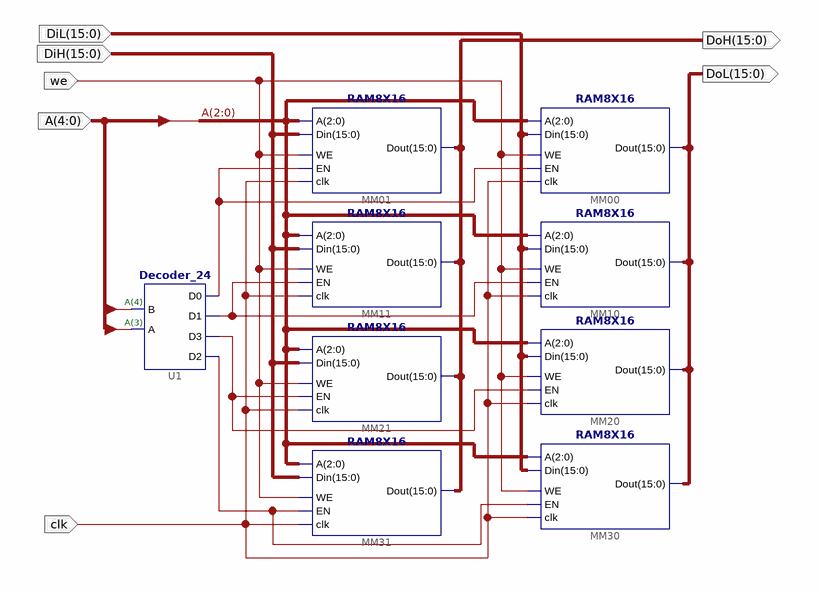
[diagram p0: schematic sheet 1]
// Xilinx ISE schematic MEM_BANK.sch (spartan3) as structural Verilog: 9 symbols, 7 ports
module MEM_BANK (
  input  [15:0] DiH,
  input  we,
  input  clk,
  input  [15:0] DiL,
  input  [4:0] A,
  output [15:0] DoH,
  output [15:0] DoL
);

  wire XLXN_3, XLXN_6, XLXN_8, XLXN_194;

  Decoder_24 U1 (.B(A[4]), .A(A[3]), .D0(XLXN_3), .D1(XLXN_6), .D3(XLXN_8), .D2(XLXN_194));
  RAM8X16 MM01 (.Dout(DoH), .Din(DiH), .A(A[2:0]), .clk(clk), .EN(XLXN_3), .WE(we));
  RAM8X16 MM11 (.Dout(DoH), .Din(DiH), .A(A[2:0]), .clk(clk), .EN(XLXN_6), .WE(we));
  RAM8X16 MM21 (.Dout(DoH), .Din(DiH), .A(A[2:0]), .clk(clk), .EN(XLXN_8), .WE(we));
  RAM8X16 MM31 (.Dout(DoH), .Din(DiH), .A(A[2:0]), .clk(clk), .EN(XLXN_194), .WE(we));
  RAM8X16 MM00 (.Dout(DoL), .Din(DiL), .A(A[2:0]), .clk(clk), .EN(XLXN_3), .WE(we));
  RAM8X16 MM10 (.Dout(DoL), .Din(DiL), .A(A[2:0]), .clk(clk), .EN(XLXN_6), .WE(we));
  RAM8X16 MM20 (.Dout(DoL), .Din(DiL), .A(A[2:0]), .clk(clk), .EN(XLXN_8), .WE(we));
  RAM8X16 MM30 (.Dout(DoL), .Din(DiL), .A(A[2:0]), .clk(clk), .EN(XLXN_194), .WE(we));

  // Notes on the sheet:
  //   A(4)
  //   A(3)
endmodule
